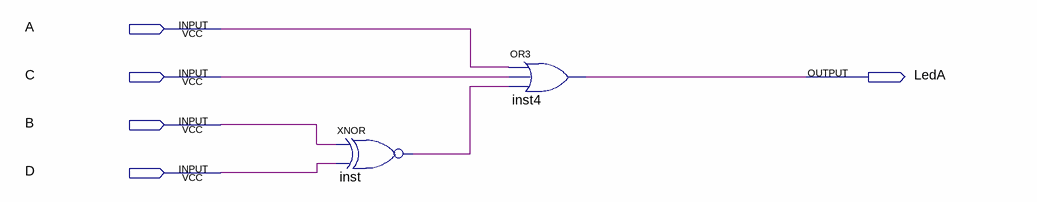
[diagram p0: schematic sheet]
// Quartus schematic LEDbcdA.bdf as structural Verilog: 2 symbols, 5 pins
module LEDbcdA (
  input  A,
  input  C,
  input  B,
  input  D,
  output LedA
);

  wire inst_out;

  xnor inst (inst_out, B, D);
  or inst4 (LedA, A, C, inst_out);
endmodule
